# EAGLE schematic RS232_adapter (EAGLE 9.0.1)
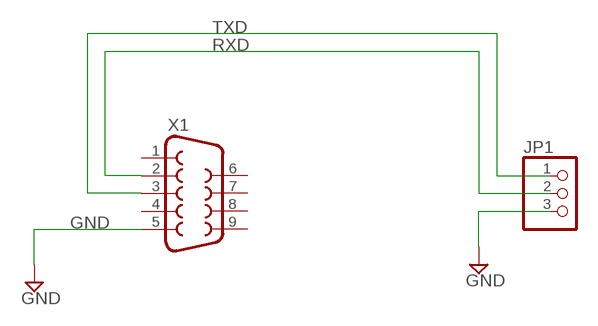
[diagram p0: schematic, sheet 1]

## Parts
JP1  PINHD-1X3  [1X03]
X1  F09V  [F09V]

## Nets
GND: JP1.3 X1.5
RXD: JP1.2 X1.2
TXD: JP1.1 X1.3
Unconnected: X1.1 X1.4 X1.6 X1.7 X1.8 X1.9

## Library data of the parts
JP1 = pinhead:PINHD-1X3: PIN HEADER
X1 = con-subd:F09: SUB-D; OC_FARNELL: unknown; OC_NEWARK: unknown